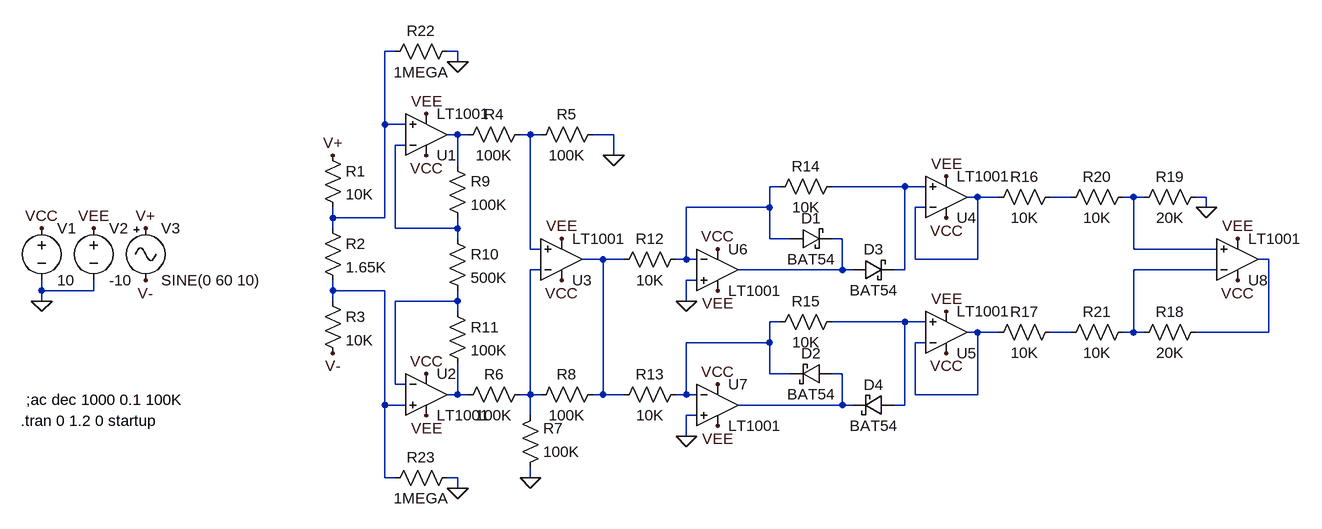
[diagram p0: schematic AFE.asc]
AFE.asc, the LTspice schematic file:
Version 4
SHEET 1 2004 680
WIRE 480 -144 464 -144
WIRE 576 -144 560 -144
WIRE 576 -128 576 -144
WIRE 464 -32 464 -144
WIRE 496 -32 464 -32
WIRE 576 -16 560 -16
WIRE 592 -16 576 -16
WIRE 688 -16 672 -16
WIRE 704 -16 688 -16
WIRE 816 -16 784 -16
WIRE 496 0 480 0
WIRE 816 16 816 -16
WIRE 576 32 576 -16
WIRE 1072 64 1056 64
WIRE 1264 64 1152 64
WIRE 1296 64 1264 64
WIRE 1376 80 1360 80
WIRE 1408 80 1376 80
WIRE 1520 80 1488 80
WIRE 1616 80 1600 80
WIRE 1632 80 1616 80
WIRE 1728 80 1712 80
WIRE 1056 96 1056 64
WIRE 1056 96 928 96
WIRE 1296 96 1280 96
WIRE 1728 96 1728 80
WIRE 384 112 384 96
WIRE 464 112 464 -32
WIRE 464 112 384 112
WIRE 384 128 384 112
WIRE 480 128 480 0
WIRE 576 128 576 112
WIRE 576 128 480 128
WIRE 576 144 576 128
WIRE 1056 144 1056 96
WIRE 1088 144 1056 144
WIRE 1168 144 1152 144
WIRE 688 160 688 -16
WIRE 704 160 688 160
WIRE 1616 160 1616 80
WIRE 1744 160 1616 160
WIRE 800 176 768 176
WIRE 832 176 800 176
WIRE 928 176 928 96
WIRE 928 176 912 176
WIRE 944 176 928 176
WIRE 1280 176 1280 96
WIRE 1376 176 1376 80
WIRE 1376 176 1280 176
WIRE 1824 176 1808 176
WIRE 704 192 688 192
WIRE 1168 192 1168 144
WIRE 1168 192 1008 192
WIRE 1184 192 1168 192
WIRE 1264 192 1264 64
WIRE 1264 192 1248 192
WIRE 1744 192 1616 192
WIRE 944 208 928 208
WIRE -64 224 -64 208
WIRE 16 224 16 208
WIRE 16 224 -64 224
WIRE 384 224 384 208
WIRE 464 224 384 224
WIRE -64 240 -64 224
WIRE 384 240 384 224
WIRE 576 240 576 224
WIRE 576 240 480 240
WIRE 928 240 928 208
WIRE 576 256 576 240
WIRE 1072 272 1056 272
WIRE 1264 272 1152 272
WIRE 1296 272 1264 272
WIRE 1376 288 1360 288
WIRE 1408 288 1376 288
WIRE 1520 288 1488 288
WIRE 1616 288 1616 192
WIRE 1616 288 1600 288
WIRE 1632 288 1616 288
WIRE 1824 288 1824 176
WIRE 1824 288 1712 288
WIRE 1056 304 1056 272
WIRE 1056 304 928 304
WIRE 1296 304 1280 304
WIRE 1056 352 1056 304
WIRE 1088 352 1056 352
WIRE 1168 352 1152 352
WIRE 480 368 480 240
WIRE 496 368 480 368
WIRE 576 384 576 336
WIRE 576 384 560 384
WIRE 592 384 576 384
WIRE 688 384 688 192
WIRE 688 384 672 384
WIRE 704 384 688 384
WIRE 800 384 800 176
WIRE 800 384 784 384
WIRE 832 384 800 384
WIRE 928 384 928 304
WIRE 928 384 912 384
WIRE 944 384 928 384
WIRE 1280 384 1280 304
WIRE 1376 384 1376 288
WIRE 1376 384 1280 384
WIRE 464 400 464 224
WIRE 496 400 464 400
WIRE 1168 400 1168 352
WIRE 1168 400 1008 400
WIRE 1184 400 1168 400
WIRE 1264 400 1264 272
WIRE 1264 400 1248 400
WIRE 688 416 688 384
WIRE 944 416 928 416
WIRE 928 448 928 416
WIRE 464 512 464 400
WIRE 480 512 464 512
WIRE 576 512 560 512
WIRE 688 512 688 496
WIRE 576 528 576 512
FLAG -64 240 0
FLAG -64 128 VCC
FLAG 16 128 VEE
FLAG 96 128 V+
FLAG 384 16 V+
FLAG 816 16 0
FLAG 528 16 VCC
FLAG 528 352 VCC
FLAG 736 208 VCC
FLAG 736 144 VEE
FLAG 528 416 VEE
FLAG 528 -48 VEE
FLAG 688 512 0
FLAG 96 208 V-
FLAG 384 320 V-
FLAG 976 224 VEE
FLAG 976 160 VCC
FLAG 976 432 VEE
FLAG 976 368 VCC
FLAG 928 240 0
FLAG 928 448 0
FLAG 1328 256 VEE
FLAG 1328 320 VCC
FLAG 1328 48 VEE
FLAG 1328 112 VCC
FLAG 1728 96 0
FLAG 1776 144 VEE
FLAG 1776 208 VCC
FLAG 576 -128 0
FLAG 576 528 0
SYMBOL voltage -64 112 R0
SYMATTR InstName V1
SYMATTR Value 10
SYMBOL voltage 16 112 R0
SYMATTR InstName V2
SYMATTR Value -10
SYMBOL Misc\\signal 96 112 R0
WINDOW 123 0 0 Left 2
WINDOW 39 0 0 Left 2
SYMATTR InstName V3
SYMATTR Value SINE(0 60 10)
SYMBOL res 368 0 R0
SYMATTR InstName R1
SYMATTR Value 10K
SYMBOL res 368 112 R0
SYMATTR InstName R2
SYMATTR Value 1.65K
SYMBOL res 368 224 R0
SYMATTR InstName R3
SYMATTR Value 10K
SYMBOL Opamps\\LT1001 528 48 M180
SYMATTR InstName U1
SYMBOL Opamps\\LT1001 528 320 R0
SYMATTR InstName U2
SYMBOL Opamps\\LT1001 736 240 M180
SYMATTR InstName U3
SYMBOL res 688 -32 R90
WINDOW 0 0 56 VBottom 2
WINDOW 3 32 56 VTop 2
SYMATTR InstName R4
SYMATTR Value 100K
SYMBOL res 800 -32 R90
WINDOW 0 0 56 VBottom 2
WINDOW 3 32 56 VTop 2
SYMATTR InstName R5
SYMATTR Value 100K
SYMBOL res 688 368 R90
WINDOW 0 0 56 VBottom 2
WINDOW 3 32 56 VTop 2
SYMATTR InstName R6
SYMATTR Value 100K
SYMBOL res 672 512 M180
WINDOW 0 36 76 Left 2
WINDOW 3 36 40 Left 2
SYMATTR InstName R7
SYMATTR Value 100K
SYMBOL res 688 400 R270
WINDOW 0 32 56 VTop 2
WINDOW 3 0 56 VBottom 2
SYMATTR InstName R8
SYMATTR Value 100K
SYMBOL res 560 16 R0
SYMATTR InstName R9
SYMATTR Value 100K
SYMBOL res 560 128 R0
SYMATTR InstName R10
SYMATTR Value 500K
SYMBOL res 560 240 R0
SYMATTR InstName R11
SYMATTR Value 100K
SYMBOL Opamps\\LT1001 976 128 R0
SYMATTR InstName U6
SYMBOL res 928 160 R90
WINDOW 0 0 56 VBottom 2
WINDOW 3 32 56 VTop 2
SYMATTR InstName R12
SYMATTR Value 10K
SYMBOL res 928 368 R90
WINDOW 0 0 56 VBottom 2
WINDOW 3 32 56 VTop 2
SYMATTR InstName R13
SYMATTR Value 10K
SYMBOL Opamps\\LT1001 976 336 R0
SYMATTR InstName U7
SYMBOL res 1168 48 R90
WINDOW 0 0 56 VBottom 2
WINDOW 3 32 56 VTop 2
SYMATTR InstName R14
SYMATTR Value 10K
SYMBOL schottky 1088 160 R270
WINDOW 0 32 32 VTop 2
WINDOW 3 0 32 VBottom 2
SYMATTR InstName D1
SYMATTR Value BAT54
SYMATTR Description Diode
SYMATTR Type diode
SYMBOL res 1168 256 R90
WINDOW 0 0 56 VBottom 2
WINDOW 3 32 56 VTop 2
SYMATTR InstName R15
SYMATTR Value 10K
SYMBOL schottky 1152 336 R90
WINDOW 0 0 32 VBottom 2
WINDOW 3 32 32 VTop 2
SYMATTR InstName D2
SYMATTR Value BAT54
SYMATTR Description Diode
SYMATTR Type diode
SYMBOL schottky 1184 208 R270
WINDOW 0 32 32 VTop 2
WINDOW 3 0 32 VBottom 2
SYMATTR InstName D3
SYMATTR Value BAT54
SYMATTR Description Diode
SYMATTR Type diode
SYMBOL schottky 1248 384 R90
WINDOW 0 0 32 VBottom 2
WINDOW 3 32 32 VTop 2
SYMATTR InstName D4
SYMATTR Value BAT54
SYMATTR Description Diode
SYMATTR Type diode
SYMBOL Opamps\\LT1001 1328 144 M180
SYMATTR InstName U4
SYMBOL Opamps\\LT1001 1328 352 M180
SYMATTR InstName U5
SYMBOL Opamps\\LT1001 1776 240 M180
SYMATTR InstName U8
SYMBOL res 1504 64 R90
WINDOW 0 0 56 VBottom 2
WINDOW 3 32 56 VTop 2
SYMATTR InstName R16
SYMATTR Value 10K
SYMBOL res 1504 272 R90
WINDOW 0 0 56 VBottom 2
WINDOW 3 32 56 VTop 2
SYMATTR InstName R17
SYMATTR Value 10K
SYMBOL res 1728 272 R90
WINDOW 0 0 56 VBottom 2
WINDOW 3 32 56 VTop 2
SYMATTR InstName R18
SYMATTR Value 20K
SYMBOL res 1728 64 R90
WINDOW 0 0 56 VBottom 2
WINDOW 3 32 56 VTop 2
SYMATTR InstName R19
SYMATTR Value 20K
SYMBOL res 1616 64 R90
WINDOW 0 0 56 VBottom 2
WINDOW 3 32 56 VTop 2
SYMATTR InstName R20
SYMATTR Value 10K
SYMBOL res 1616 272 R90
WINDOW 0 0 56 VBottom 2
WINDOW 3 32 56 VTop 2
SYMATTR InstName R21
SYMATTR Value 10K
SYMBOL res 464 -128 R270
WINDOW 0 32 56 VTop 2
WINDOW 3 0 56 VBottom 2
SYMATTR InstName R22
SYMATTR Value 1MEGA
SYMBOL res 464 528 R270
WINDOW 0 32 56 VTop 2
WINDOW 3 0 56 VBottom 2
SYMATTR InstName R23
SYMATTR Value 1MEGA
TEXT -96 424 Left 2 !.tran 0 1.2 0 startup
TEXT -88 392 Left 2 !;ac dec 1000 0.1 100K

The netlist it stands for:
* AFE.asc
V1 VCC 0 10
V2 VEE 0 -10
V3 V+ V- SINE(0 60 10)
R1 V+ N001 10K
R2 N001 N015 1.65K
R3 N015 V- 10K
XU1 N001 N004 VCC VEE N002 LT1001  ; pins In+ In- V+ V- OUT
XU2 N015 N016 VCC VEE N022 LT1001  ; pins In+ In- V+ V- OUT
XU3 N003 N013 VCC VEE N011 LT1001  ; pins In+ In- V+ V- OUT
R4 N003 N002 100K
R5 0 N003 100K
R6 N013 N022 100K
R7 0 N013 100K
R8 N013 N011 100K
R9 N002 N004 100K
R10 N004 N016 500K
R11 N016 N022 100K
XU6 0 N005 VCC VEE N010 LT1001  ; pins In+ In- V+ V- OUT
R12 N005 N011 10K
R13 N017 N011 10K
XU7 0 N017 VCC VEE N021 LT1001  ; pins In+ In- V+ V- OUT
R14 N006 N005 10K
D1 N005 N010 BAT54
R15 N018 N017 10K
D2 N021 N017 BAT54
D3 N010 N006 BAT54
D4 N018 N021 BAT54
XU4 N006 N007 VCC VEE N007 LT1001  ; pins In+ In- V+ V- OUT
XU5 N018 N019 VCC VEE N019 LT1001  ; pins In+ In- V+ V- OUT
XU8 N009 N014 VCC VEE N012 LT1001  ; pins In+ In- V+ V- OUT
R16 N008 N007 10K
R17 N020 N019 10K
R18 N012 N014 20K
R19 0 N009 20K
R20 N009 N008 10K
R21 N014 N020 10K
R22 N001 0 1MEGA
R23 N015 0 1MEGA
.model D D
.lib standard.dio
.tran 0 1.2 0 startup
;ac dec 1000 0.1 100K
.lib LTC.lib
.backanno
.end